# Altium schematic sheet Sensor de temperatura.SchDoc
size Legal; SheetNumber: 6; SheetTotal: 8
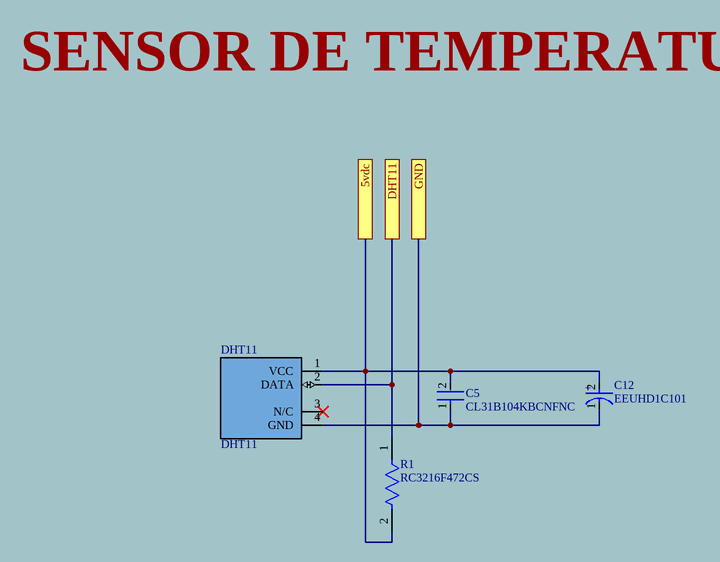
[diagram p0: Sensor de temperatura.SchDoc]

## Parts
C5  CL31B104KBCNFNC  [FP-CL31-IPC_C]
C12  EEUHD1C101  [FP-RAD-TH-D_5_0_5-L_11_1-MFG]
DHT11  DHT11  [DHT11]
R1  RC3216F472CS  [FP-RC3216-MFG]

## Ports
5vdc, DHT11, GND

## Nets
5vdc: C5.2 C12.2(A) DHT11.1(VCC) R1.2 ; port 5vdc
DHT11: DHT11.2(DATA) R1.1 ; port DHT11
GND: C5.1 C12.1(C) DHT11.4(GND) ; port GND

Not connected (* = marked no-connect by the designer): DHT11 3(N/C)*

## Notes on the sheet
- SENSOR DE TEMPERATURA
- (in symbol CMP-05427-000949-1) +

## Library data of the parts
C5 = CMP-13271-001276-1: Cap Ceramic 100nF 50V X7R ±10% SMD 1206 +125°C Embossed T/R; Dielectric: X7R; Case Code (Metric): 3216; Package Quantity: 1; Thickness: 0.037inch; Depth: 1.6mm; Packaging: Tape and Reel; Capacitance: 100nF; Length: 0.126inch; Tolerance: 10%; Voltage Rating: 50V; Case Code (Imperial): 1206; Radiation Hardening: No; Width: 0.063inch; Case/Package: 1206; Max Operating Temperature: 125°C; Min Operating Temperature: -55°C; Height: 0.85mm; Mount: Surface Mount
C12 = CMP-05427-000949-1: Aluminum Electrolytic Capacitors (Radial Lead Type) AEC-Q200 Qualified 100uF ±20% 16V; Lead/Base Style: Straight; Life (Hours): 1000Hour; Polarity: Polar; Ripple Current: 110mA; Lead Diameter: 0.5mm; Packaging: Bulk; Tolerance: 20%; Package Quantity: 200; Lead Pitch: 2.5mm; RoHS Compliant: Yes; Length: 11mm; Capacitance: 100uF; Max Operating Temperature: 105°C; REACH SVHC: No SVHC; Termination: Radial; Lead Free: Lead Free; Number of Pins: 2; Ripple Current (AC): 110mA; Mount: Through Hole; Diameter: 5mm; Min Operating Temperature: -55°C; Construction: RADIAL; Voltage Rating: 16V; Voltage Rating (DC): 16V; Case/Package: Radial; Height: 11mm; Height - Seated (Max): 0.492inch; Voltage: 16V; Series: HD
DHT11 = DHT11: SENSOR DE TEMPERATURA
R1 = CMP-13261-005727-1: Res Thick Film 1206 4.7kΩ 1% 0.25W ±100ppm/°C Molded SMD T/R; Max Power Dissipation: 250mW; Resistance: 4.7kR; Voltage Rating (DC): 200V; Case Code (Metric): 3216; Number of Terminations: 2; Length: 0.126inch; Case/Package: 1206; Contact Plating: Tin; Features: Moisture Resistant; Radiation Hardening: No; Tolerance: 1%; Min Operating Temperature: -55°C; Depth: 1.6mm; Lead Free: Lead Free; Composition: Thick Film; Height: 0.026inch; Width: 0.063inch; Temperature Coefficient: 100ppm/°C; Max Operating Temperature: 155°C; Packaging: Tape and Reel; Case Code (Imperial): 1206; Military Standard: Not